# EasyEDA Pro project ProPrj_农装B类小车V2_2025-10-25.epro, board PCB4
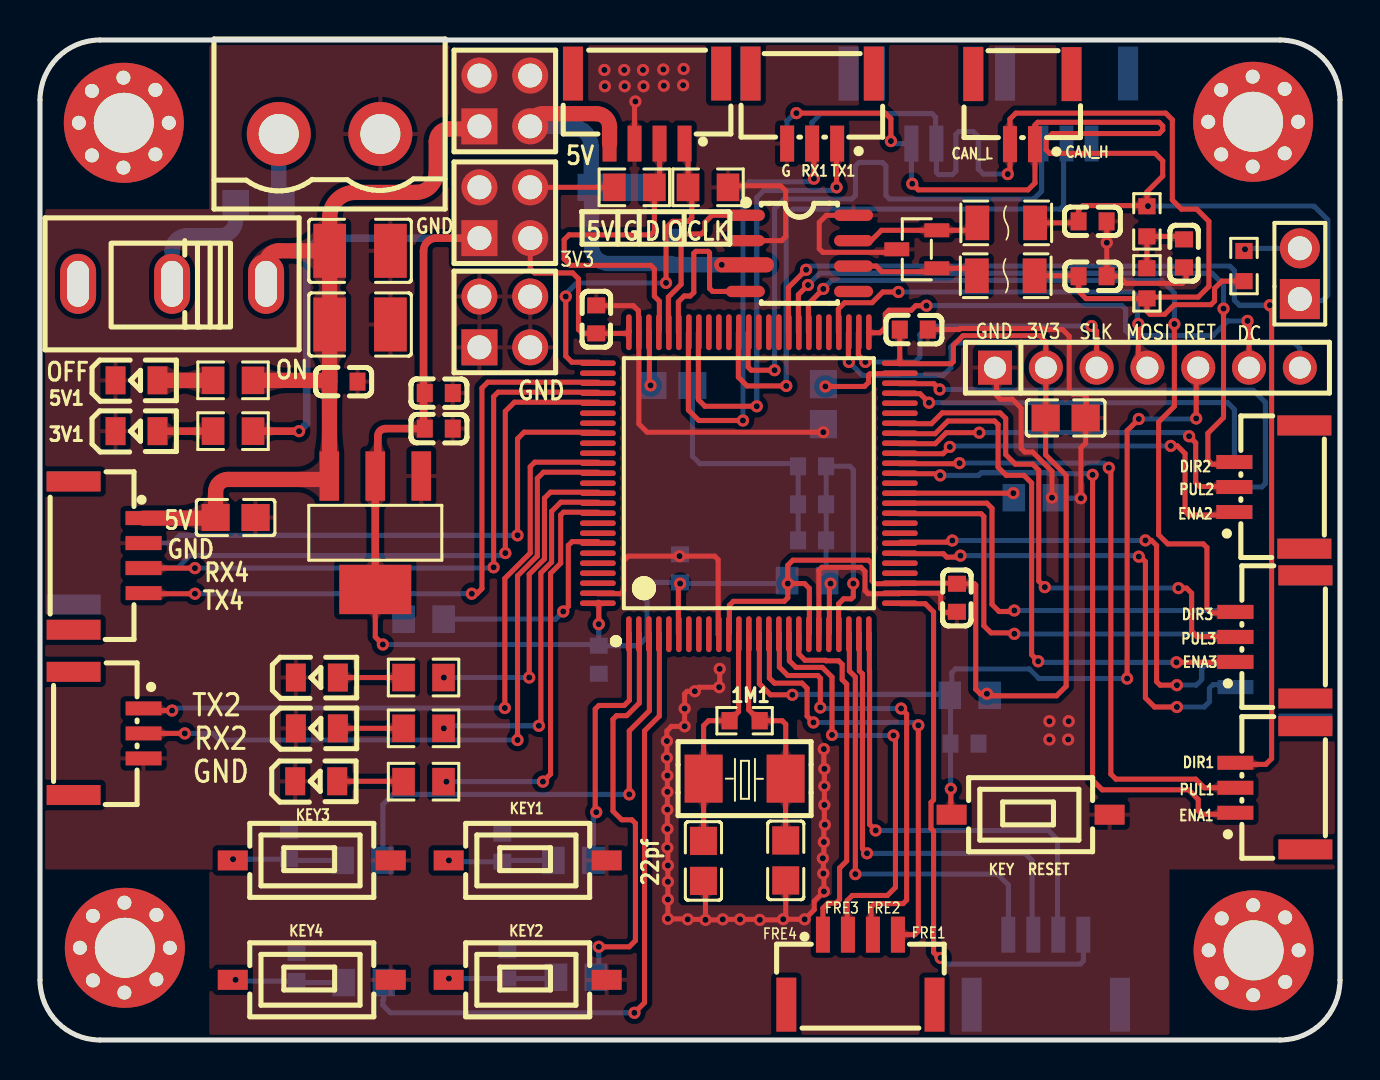
[diagram p0: board, top side]
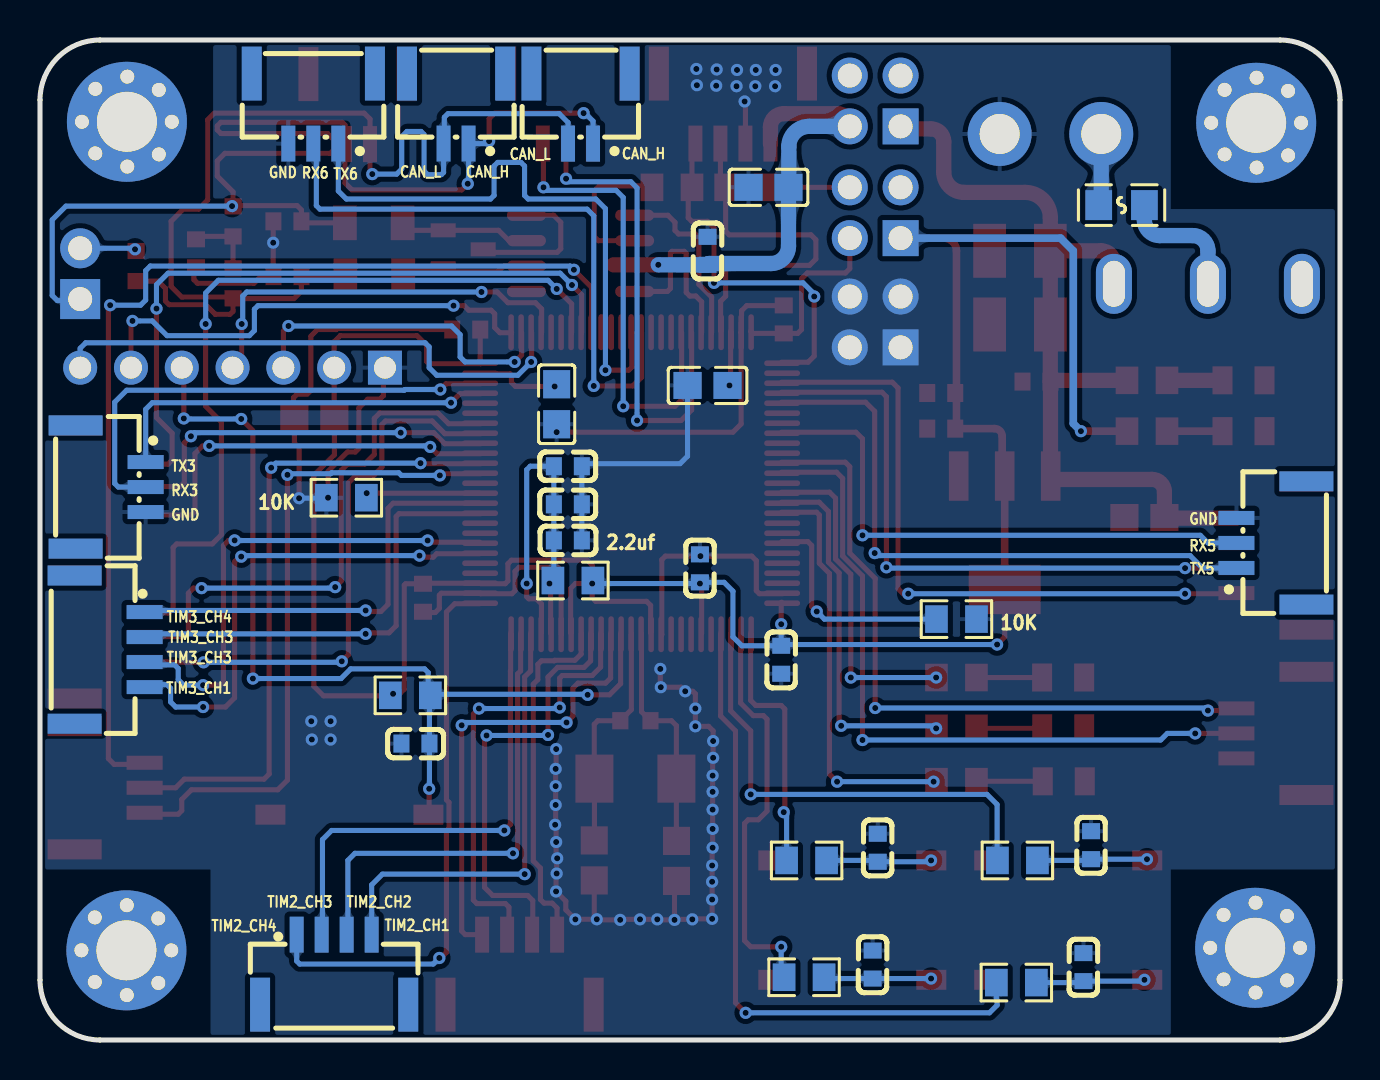
[diagram p1: board, bottom side, seen from below]

Outline 65 x 50 mm; copper layers: Top Layer, Bottom Layer. Coordinates in mm from the lower left corner of the outline.
Outline path: 0,47 0,3 arc(0.88,0.88) 3,0 62,0 arc(64.12,0.88) 65,3 65,47 arc(64.12,49.12) 62,50 3,50 arc(0.88,49.12) 0,47
Stack: Top Layer 0.035mm / Dielectric1 1.51mm FR4 er 4.5 / Bottom Layer 0.035mm

## Design rules (mm)
net OSC_OUT: DP2
net OSC_IN: DP2
net CAN1_L: DP5
net CAN1_H: DP5
net SWDIO: DP1
net SWCLK: DP1
net USART6_TX: DP6
net USART6_RX: DP6
net $1N9680: DP4
net $1N9681: DP4
net CAN1_RX: DP3
net CAN1_TX: DP3
template: JLCPCB Capability(Two Layers Board)
spacing copperThickness1oz (default): track to track 0.102, other pairs 0.152 to 0.3
spacing copperThickness2oz: track to track 0.203, other pairs 0.152 to 0.3
track width copperThickness1oz (default): min 0.127, default 0.254, max 2.54
track width copperThickness2oz: min 0.203, default 0.254, max 2.54
differential pair differentialPair (default): width min 0.127, default 0.254, max 2.54; gap min 0.152, default 0.152
via viaSize (default): diameter min 0.5, default 0.61, max 10; hole min 0.3, default 0.305, max 6.3

## Placement (name value [footprint] x y rotation side)
1M1  SCR0603J1K  [R0603]  35.23 15.96 0 top
2.2uf  100nF  [C0603]  38.61 24.98 0 bottom
3V1  NCD0805R1  [LED0805-R-RD]  4.83 30.44 0 top
5V1  NCD0805R1  [LED0805-R-RD]  4.83 32.98 0 top
10K  -  [R0805]  19.18 21.04 180 bottom
10K#2  -  [R0805]  49.68 27.11 0 bottom
C1  104  [C0603]  23.11 9.61 90 bottom
C1_22pf1  22pf  [C0805]  37.29 8.98 90 top
C2_22pf1  100nF  [C0805]  33.17 8.95 90 top
C5  104  [C0603]  45.85 22.11 90 top
C6  104  [C0603]  43.69 35.52 180 top
C7  104  [C0603]  32 23.58 270 bottom
C8  104  [C0603]  27.94 19.01 90 bottom
C9  104  [C0603]  27.81 36.03 270 top
C10  106  [C0603]  19.94 32.35 180 top
C22  104  [C0603]  31.62 39.46 90 bottom
C25  104  [C0805]  51.28 31.1 180 top
C26  22p  [C0603]  52.63 38.19 180 top
C27  22p  [C0603]  57.2 39.33 270 top
C34_106  106  [C0603]  38.61 26.78 180 bottom
C35_104  104  [C0603]  38.61 28.69 180 bottom
C39  104  [C0603]  46.23 14.82 0 bottom
C40  104  [C0805]  28.57 42.63 0 bottom
C43  104  [C0805]  9.78 26.12 180 top
C44  2.2uf  [C0805]  39.17 31.79 270 bottom
C45  2.2uf  [C0805]  31.62 32.73 0 bottom
C52  104  [C0603]  15.18 32.92 180 top
C53  104  [C0603]  19.94 30.57 180 top
C54  100uF  [C1210]  16 39.46 0 top
C55  100uF  [C1210]  16 35.78 0 top
C56  104  [C0603]  23.37 3.77 90 bottom
C57  104  [C0603]  12.45 9.74 90 bottom
C58  104  [C0603]  12.83 3.65 90 bottom
C64  22p  [C0603]  52.63 40.93 0 top
CN24  DB2EVC-5.08-2P-GN  [CONN-TH_2P-P5.08_DB2EVC-5.08-2P]  14.48 45.3 180 top
CN32  GH125-S04DCA-00  [CONN-SMD_4P-P1.27_GH125-S04DCA-00]  30.35 46.57 180 top
CN46  GH125-S04DCA-00  [CONN-SMD_4P-P1.27_GH125-S04DCA-00]  3.43 24.22 270 top
CN47  GH125-S04DCA-00  [CONN-SMD_4P-P1.27_GH125-S04DCA-00]  50.29 3.52 180 bottom
CN48  GH125-S04DCA-00  [CONN-SMD_4P-P1.27_GH125-S04DCA-00]  61.52 19.52 270 bottom
CN49  GH125-S04DCA-00  [CONN-SMD_4P-P1.27_GH125-S04DCA-00]  41.02 3.52 0 top
D1  NUP2105LT1G-TP  [SOT-23-3_L2.9-W1.3-P1.90-LS2.4-BR]  43.84 39.54 0 top
F1  BSMD0805-100-6V  [F0805]  10.92 41.75 0 bottom
F3  nSMD020-30V  [F1206]  48.29 38.21 0 top
F4  nSMD020-30V  [F1206]  48.31 40.86 0 top
H25  PZ254V-11-07P  [HDR-TH_7P-P2.54-V-M]  55.37 33.62 0 top
H26  A2541WV-2x2P  [HDR-TH_4P-P2.54-V-R2-C2-S2.54_A2541WV-2X2P]  23.24 35.9 0 top
H27  A2541WV-2x2P  [HDR-TH_4P-P2.54-V-R2-C2-S2.54_A2541WV-2X2P]  23.24 46.95 0 top
H28  A2541WV-2x2P  [HDR-TH_4P-P2.54-V-R2-C2-S2.54_A2541WV-2X2P]  23.24 41.36 0 top
H29  PZ254V-11-02P  [HDR-TH_2P-P2.54-V-M]  62.99 38.32 90 top
key1  TS-1092S-B3D2-G  [SW-SMD_L6.1-W3.6-LS7.9]  24.38 8.98 0 top
key2  TS-1092S-B3D2-G  [SW-SMD_L6.1-W3.6-LS7.9]  24.38 3.01 0 top
key3  TS-1092S-B3D2-G  [SW-SMD_L6.1-W3.6-LS7.9]  13.59 8.98 0 top
key4  TS-1092S-B3D2-G  [SW-SMD_L6.1-W3.6-LS7.9]  13.59 3.01 0 top
LED1  NCD0805R1  [LED0805-R-RD]  13.84 18.12 0 top
LED2  NCD0805R1  [LED0805-R-RD]  13.84 15.58 0 top
LED3  NCD0805R1  [LED0805-R-RD]  13.81 12.94 0 top
NOREF  -  [Pad_e1881]  6.44 45.86 270 top
NOREF#2  -  [Pad_e1906]  62.26 6.13 0 top
NOREF#3  -  [Pad_e1933]  2.65 2.98 0 top
NOREF#4  -  [Pad_e1896]  62.91 45.91 270 top
NOREF#5  -  [Pad_e1932]  2 4.61 270 top
NOREF#6  -  [Pad_e1884]  2.59 47.46 0 top
NOREF#7  -  [Pad_e1885]  1.95 45.86 270 top
NOREF#8  -  [Pad_e1922]  60.68 4.48 180 top
NOREF#9  -  [Pad_e1923]  6.49 4.61 270 top
NOREF#10  -  [Pad_e1925]  4.22 6.87 180 top
NOREF#11  -  [Pad_e1916]  60.66 2.24 180 top
NOREF#12  -  [Pad_e1927]  2.65 6.21 0 top
NOREF#13  -  [Pad_e1913]  59.08 6.08 0 top
NOREF#14  -  [Pad_e1905]  62.93 4.48 270 top
NOREF#15  -  [Pad_e1902]  60.63 43.67 180 top
NOREF#16  -  [Pad_e1901]  59.06 44.28 0 top
NOREF#17  -  [Pad_e1900]  58.41 45.91 270 top
NOREF#18  -  [Pad_e1886]  2.59 44.23 0 top
NOREF#19  -  [Pad_e1899]  59.06 47.51 0 top
NOREF#20  -  [Pad_e1904]  60.66 45.91 180 top
NOREF#21  -  [Pad_e1924]  5.82 6.26 0 top
NOREF#22  -  [Pad_e1903]  62.23 44.33 0 top
NOREF#23  -  [Pad_e1940]  4.24 4.61 180 top
NOREF#24  -  [Pad_e1914]  58.44 4.48 270 top
NOREF#25  -  [Pad_e1907]  60.66 6.74 180 top
NOREF#26  -  [Pad_e1897]  62.23 47.56 0 top
NOREF#27  -  [Pad_e1935]  5.82 3.03 0 top
NOREF#28  -  [Pad_e1890]  4.19 45.86 180 top
NOREF#29  -  [Pad_e1934]  4.22 2.37 180 top
NOREF#30  -  [Pad_e1898]  60.63 48.17 180 top
NOREF#31  -  [Pad_e1915]  59.08 2.85 0 top
NOREF#32  -  [Pad_e1889]  5.77 44.28 0 top
NOREF#33  -  [Pad_e1883]  4.17 48.12 180 top
NOREF#34  -  [Pad_e1917]  62.26 2.9 0 top
NOREF#35  -  [Pad_e1882]  5.77 47.51 0 top
NOREF#36  -  [Pad_e1887]  4.17 43.62 180 top
R6_1k1  1K  [R0805]  26.67 8.98 180 bottom
R7_1K1  1K  [R0805]  26.8 3.14 180 bottom
R8_1K1  1K  [R0805]  16.13 8.98 180 bottom
R10_2K1  2K  [R0805]  19.18 15.58 180 top
R10_2K2  2K  [R0805]  19.18 12.92 180 top
R10_10K1  10K  [R0805]  9.65 30.44 180 top
R10_10K2  10K  [R0805]  29.72 42.63 0 top
R10_10K3  10K  [R0805]  33.4 42.63 180 top
R13_2K1  2K  [R0805]  19.18 18.12 180 top
R13_10K1  10K  [R0805]  9.65 32.98 180 top
R19  60R  [R0603]  55.35 40.93 90 top
R20  60R4  [R0603]  55.35 37.83 90 top
R27_0Ω1  0K  [R0805]  38.35 22.97 0 bottom
R30  10K  [R0805]  46.48 17.23 180 bottom
R31  120R  [R0603]  60.2 38.7 270 top
R31_1K1  1K  [R0805]  16.18 2.87 180 bottom
RESET1  TS-1092S-B3D2-G  [SW-SMD_L6.1-W3.6-LS7.9]  49.53 11.27 0 top
U3  单刀双掷  [SW-TH_SS-12D10-G050]  6.6 37.81 180 top
U4  -  [407vgt6]  37.06 29.38 45 top
U10  SK12D07VG3  [SOT-223-4_L6.5-W3.5-P2.30-LS7.0-BR]  16.76 25.36 90 top
U13  TJA1050T/CM,118  [SOIC-8_L5.0-W4.0-P1.27-LS6.0-BL]  37.97 39.33 270 top
X1  8MHz  [CRYSTAL-SMD_L5.0-W3.2]  35.23 13.07 0 top
X2  GH125-S02DCA-00  [CONN-SMD_2P-P1.25_JUSHUO_GH125-S02DCA-00]  44.2 46.57 0 bottom
X3  GH125-S02DCA-00  [CONN-SMD_2P-P1.25_JUSHUO_GH125-S02DCA-00]  49.12 46.55 180 top
X4  GH125-S02DCA-00  [CONN-SMD_2P-P1.25_JUSHUO_GH125-S02DCA-00]  37.97 46.57 0 bottom
X5  GH125-S03DCA-00  [CONN-SMD_3P-P1.25_JUSHUO_GH125-S03DCA-00]  3.43 15.33 270 top
X6  GH125-S03DCA-00  [CONN-SMD_3P-P1.25_JUSHUO_GH125-S03DCA-00]  38.61 46.57 180 top
X7  GH125-S03DCA-00  [CONN-SMD_3P-P1.25_JUSHUO_GH125-S03DCA-00]  61.47 27.65 270 bottom
X8  GH125-S03DCA-00  [CONN-SMD_3P-P1.25_JUSHUO_GH125-S03DCA-00]  3.43 24.85 90 bottom
X9  GH125-S03DCA-00  [CONN-SMD_3P-P1.25_JUSHUO_GH125-S03DCA-00]  61.52 12.61 90 top
X11  GH125-S03DCA-00  [CONN-SMD_3P-P1.25_JUSHUO_GH125-S03DCA-00]  61.52 20.16 90 top
X12  GH125-S03DCA-00  [CONN-SMD_3P-P1.25_JUSHUO_GH125-S03DCA-00]  61.47 27.65 90 top
X13  GH125-S03DCA-00  [CONN-SMD_3P-P1.25_JUSHUO_GH125-S03DCA-00]  51.33 46.57 0 bottom

## Footprints (pads in the part's own frame, mm; a bottom-side part is the same pattern mirrored in y, then rotated)
407vgt6
  oval 0.28x1.796 smd rot 135: 1(-11.809,-1.04) 2(-11.456,-1.393) 3(-11.101,-1.747) 4(-10.748,-2.1) 5(-10.394,-2.454) 6(-10.041,-2.808) 7(-9.687,-3.161) 8(-9.334,-3.514) 9(-8.98,-3.868) 10(-8.627,-4.221) 11(-8.273,-4.575) 12(-7.92,-4.929) 13(-7.566,-5.282) 14(-7.213,-5.636) 15(-6.859,-5.989) 16(-6.505,-6.343) 17(-6.152,-6.697) 18(-5.798,-7.05) 19(-5.445,-7.404) 20(-5.091,-7.757) 21(-4.737,-8.111) 22(-4.384,-8.464) 23(-4.03,-8.818) 24(-3.677,-9.171) 25(-3.323,-9.525) 51(7.354,1.152) 52(7,1.506) 53(6.646,1.859) 54(6.293,2.213) 55(5.939,2.567) 56(5.586,2.92) 57(5.232,3.273) 58(4.879,3.627) 59(4.525,3.981) 60(4.172,4.334) 61(3.818,4.688) 62(3.465,5.041) 63(3.111,5.395) 64(2.757,5.748) 65(2.404,6.102) 66(2.05,6.455) 67(1.697,6.809) 68(1.343,7.162) 69(0.99,7.516) 70(0.636,7.87) 71(0.282,8.223) 72(-0.071,8.577) 73(-0.424,8.931) 74(-0.778,9.284) 75(-1.131,9.637)
  oval 1.796x0.28 smd rot 135: 26(-1.131,-9.525) 27(-0.778,-9.171) 28(-0.424,-8.818) 29(-0.071,-8.464) 30(0.282,-8.111) 31(0.636,-7.758) 32(0.99,-7.404) 33(1.343,-7.05) 34(1.697,-6.697) 35(2.05,-6.343) 36(2.404,-5.989) 37(2.757,-5.636) 38(3.111,-5.282) 39(3.465,-4.928) 40(3.818,-4.575) 41(4.172,-4.221) 42(4.525,-3.868) 43(4.879,-3.514) 44(5.232,-3.161) 45(5.586,-2.808) 46(5.939,-2.454) 47(6.293,-2.1) 48(6.646,-1.747) 49(7,-1.393) 50(7.354,-1.04) 76(-3.324,9.637) 77(-3.677,9.284) 78(-4.03,8.931) 79(-4.384,8.577) 80(-4.737,8.223) 81(-5.091,7.87) 82(-5.445,7.516) 83(-5.798,7.162) 84(-6.152,6.809) 85(-6.505,6.455) 86(-6.859,6.102) 87(-7.213,5.748) 88(-7.566,5.395) 89(-7.92,5.042) 90(-8.273,4.688) 91(-8.627,4.334) 92(-8.98,3.981) 93(-9.334,3.627) 94(-9.688,3.273) 95(-10.041,2.92) 96(-10.395,2.567) 97(-10.748,2.213) 98(-11.101,1.859) 99(-11.456,1.506) 100(-11.809,1.152)
C0603
  rect 0.8x0.9 smd: 1(-0.7,0) 2(0.7,0)
C0805
  rect 1.41x1.35 smd: 1(-1,0) 2(1,0)
C1210
  rect 1.635x2.7 smd: 1(-1.518,0) 2(1.518,0)
CONN-SMD_2P-P1.25_JUSHUO_GH125-S02DCA-00
  rect 0.7x1.8 smd: 1(-0.625,1.75) 2(0.625,1.75)
  rect 1x2.7 smd: 3(2.455,-1.75) 4(-2.455,-1.75)
CONN-SMD_3P-P1.25_JUSHUO_GH125-S03DCA-00
  rect 0.7x1.8 smd: 1(-1.25,1.75) 2(0,1.75) 3(1.25,1.75)
  rect 1x2.7 smd: 4(3.08,-1.75) 5(-3.08,-1.75)
CONN-SMD_4P-P1.27_GH125-S04DCA-00
  rect 0.7x1.8 smd: 1(-1.875,1.75) 2(-0.625,1.75) 3(0.625,1.75) 4(1.875,1.75)
  rect 1x2.7 smd: 5(3.705,-1.75) 6(-3.705,-1.75)
CONN-TH_2P-P5.08_DB2EVC-5.08-2P
  round 3.2 hole 2: 1(-2.54,0) 2(2.54,0)
CRYSTAL-SMD_L5.0-W3.2
  rect 1.9x2.401 smd: 1(-2.05,0) 2(2.05,0)
F0805
  rect 1.335x1.5 smd: 1(-1.143,0) 2(1.143,0)
F1206
  rect 1.19x1.728 smd: 1(-1.445,0) 2(1.445,0)
HDR-TH_2P-P2.54-V-M
  rect 2x2 hole 1.2: 1(-1.27,0)
  round 2 hole 1.2: 2(1.27,0)
HDR-TH_4P-P2.54-V-R2-C2-S2.54_A2541WV-2X2P
  rect 1.8x1.8 hole 1.2: 1(-1.27,-1.27)
  round 1.8 hole 1.2: 2(-1.27,1.27) 3(1.27,-1.27) 4(1.27,1.27)
HDR-TH_7P-P2.54-V-M
  rect 1.7x1.7 hole 1.1: 1(-7.62,0)
  round 1.7 hole 1.1: 2(-5.08,0) 3(-2.54,0) 4(0,0) 5(2.54,0) 6(5.08,0) 7(7.62,0)
LED0805-R-RD
  rect 1x1.399 smd: 1(1.05,0) 2(-1.05,0)
Pad_e1881
  round 1.2 hole 0.7: 1(0,0)
Pad_e1882
  round 1.2 hole 0.7: 1(0,0)
Pad_e1883
  round 1.2 hole 0.7: 1(0,0)
Pad_e1884
  round 1.2 hole 0.7: 1(0,0)
Pad_e1885
  round 1.2 hole 0.7: 1(0,0)
Pad_e1886
  round 1.2 hole 0.7: 1(0,0)
Pad_e1887
  round 1.2 hole 0.7: 1(0,0)
Pad_e1889
  round 1.2 hole 0.7: 1(0,0)
Pad_e1890
  round 6 hole 3: 1(0,0)
Pad_e1896
  round 1.2 hole 0.7: 1(0,0)
Pad_e1897
  round 1.2 hole 0.7: 1(0,0)
Pad_e1898
  round 1.2 hole 0.7: 1(0,0)
Pad_e1899
  round 1.2 hole 0.7: 1(0,0)
Pad_e1900
  round 1.2 hole 0.7: 1(0,0)
Pad_e1901
  round 1.2 hole 0.7: 1(0,0)
Pad_e1902
  round 1.2 hole 0.7: 1(0,0)
Pad_e1903
  round 1.2 hole 0.7: 1(0,0)
Pad_e1904
  round 6 hole 3: 1(0,0)
Pad_e1905
  round 1.2 hole 0.7: 1(0,0)
Pad_e1906
  round 1.2 hole 0.7: 1(0,0)
Pad_e1907
  round 1.2 hole 0.7: 1(0,0)
Pad_e1913
  round 1.2 hole 0.7: 1(0,0)
Pad_e1914
  round 1.2 hole 0.7: 1(0,0)
Pad_e1915
  round 1.2 hole 0.7: 1(0,0)
Pad_e1916
  round 1.2 hole 0.7: 1(0,0)
Pad_e1917
  round 1.2 hole 0.7: 1(0,0)
Pad_e1922
  round 6 hole 3: 1(0,0)
Pad_e1923
  round 1.2 hole 0.7: 1(0,0)
Pad_e1924
  round 1.2 hole 0.7: 1(0,0)
Pad_e1925
  round 1.2 hole 0.7: 1(0,0)
Pad_e1927
  round 1.2 hole 0.7: 1(0,0)
Pad_e1932
  round 1.2 hole 0.7: 1(0,0)
Pad_e1933
  round 1.2 hole 0.7: 1(0,0)
Pad_e1934
  round 1.2 hole 0.7: 1(0,0)
Pad_e1935
  round 1.2 hole 0.7: 1(0,0)
Pad_e1940
  round 6 hole 3: 1(0,0)
R0603
  rect 0.806x0.864 smd: 1(-0.753,0) 2(0.753,0)
R0805
  rect 1.133x1.377 smd: 1(-1,0) 2(1,0)
SOIC-8_L5.0-W4.0-P1.27-LS6.0-BL
  oval 0.569x1.95 smd: 1(-1.905,-2.705) 2(-0.635,-2.705) 3(0.635,-2.705) 4(1.905,-2.705) 5(1.905,2.705) 6(0.635,2.705) 7(-0.635,2.705) 8(-1.905,2.705)
SOT-23-3_L2.9-W1.3-P1.90-LS2.4-BR
  rect 1.25x0.7 smd: 1(1,-0.95) 2(1,0.95) 3(-1,0)
SOT-223-4_L6.5-W3.5-P2.30-LS7.0-BR
  rect 2.47x0.98 smd: 1(2.835,-2.3) 2(2.835,0) 3(2.835,2.3)
  rect 2.47x3.6 smd: 4(-2.835,0)
SW-SMD_L6.1-W3.6-LS7.9
  rect 1.5x1 smd: 1(-3.95,0) 2(3.95,0)
SW-TH_SS-12D10-G050
  oval 1.8x3 hole 1.1x2.3: 1(-4.7,0) 2(0,0) 3(4.7,0)

## Nets
GND: 2.2uf.1 3V1.2 5V1.2 10K.2 10K#2.2 C1.2 C1_22pf1.1 C2_22pf1.1 C5.1 C6.1 C7.1 C8.1 C9.1 C10.1 C22.2 C25.1 C26.1 C27.2 C34_106.2 C35_104.2 C39.2 C40.2 C43.1 C44.2 C45.2 C52.1 C53.1 C54.2 C55.2 C56.2 C57.2 C58.2 C64.2 CN24.1 CN32.3 CN46.2 D1.3 H25.1 H26.1 H26.2 H26.3 H26.4 key1.2 key2.2 key3.2 key4.2 LED1.2 LED2.2 LED3.2 R10_10K3.1 RESET1.2 U4.10 U4.20 U4.27 U4.74 U4.99 U10.1 U13.2 U13.8 X5.3 X6.3 X7.3 X8.3 X13.3
VCC3V3: C5.2 C6.2 C7.2 C8.2 C9.2 C10.2 C25.2 C53.2 H25.2 H28.1 H28.2 H28.3 H28.4 R10_10K1.1 R10_10K2.1 R27_0Ω1.1 R30.1 U4.6 U4.11 U4.19 U4.28 U4.50 U4.75 U4.100 U10.2 U10.4
VCC5V: C22.1 C40.1 C43.2 C52.2 C54.1 C55.1 CN32.4 CN46.1 H27.1 H27.2 H27.3 H27.4 R13_10K1.1 U3.1 U10.3 U13.3
BOOT0: 10K.1 U4.94
BOOT1: 10K#2.1 U4.37
CAN1_H: C64.1 F4.2 H29.1 R19.2 X2.1 X3.1 X4.1
CAN1_L: C26.2 F3.2 R20.1 R31.2 X2.2 X3.2 X4.2
CAN1_RX: U4.70 U13.4
CAN1_TX: U4.71 U13.1
FREE_IO1: CN49.4 U4.15
FREE_IO2: CN49.3 U4.16
FREE_IO3: CN49.2 U4.17
FREE_IO4: CN49.1 U4.18
KEY1: R6_1k1.1 U4.1
KEY2: R7_1K1.1 U4.2
KEY3: R8_1K1.1 U4.3
KEY4: R31_1K1.1 U4.4
LED1: R13_2K1.1 U4.89
LED2: R10_2K1.1 U4.90
LED3: R10_2K2.1 U4.91
M1_DIR: U4.59 X9.3
M1_ENA: U4.39 X9.1
M1_PUL: U4.40 X9.2
M2_DIR: U4.58 X12.3
M2_ENA: U4.41 X12.1
M2_PUL: U4.42 X12.2
M3_DIR: U4.57 X11.3
M3_ENA: U4.43 X11.1
M3_PUL: U4.44 X11.2
OLED_CS: H25.7 U4.53
OLED_DC: H25.6 U4.51
OLED_MOSI: H25.4 U4.54
OLED_SCK: H25.3 U4.52
OSC_IN: 1M1.1 C2_22pf1.2 U4.12 X1.1
OSC_OUT: 1M1.2 C1_22pf1.2 U4.13 X1.2
POWER5V: F1.1 U3.2
RESET: C39.1 H25.5 R30.2 RESET1.1 U4.14
SWCLK: CN32.1 R10_10K3.2 U4.76
SWDIO: CN32.2 R10_10K2.2 U4.72
TIM2_CH1: CN47.4 U4.23
TIM2_CH2: CN47.3 U4.24
TIM2_CH3: CN47.2 U4.25
TIM2_CH4: CN47.1 U4.26
TIM3_CH1: CN48.4 U4.31
TIM3_CH2: CN48.3 U4.32
TIM3_CH3: CN48.2 U4.35
TIM3_CH4: CN48.1 U4.36
USART1_RX: U4.69 X6.2
USART1_TX: U4.68 X6.1
USART2_RX: U4.87 X5.2
USART2_TX: U4.86 X5.1
USART3_RX: U4.48 X7.2
USART3_TX: U4.47 X7.1
USART4_RX: CN46.3 U4.79
USART4_TX: CN46.4 U4.78
USART5_RX: U4.83 X8.2
USART5_TX: U4.80 X8.1
USART6_RX: U4.64 X13.2
USART6_TX: U4.63 X13.1
$1N9341: U4.92
$1N9342: U4.93
$1N9363: C44.1 U4.49
$1N9364: C45.1 U4.73
$1N9368: 2.2uf.2 C34_106.1 C35_104.1 R27_0Ω1.2 U4.21 U4.22
$1N9402: C1.1 key1.1 R6_1k1.2
$1N9403: C56.1 key2.1 R7_1K1.2
$1N9404: C57.1 key3.1 R8_1K1.2
$1N9411: C58.1 key4.1 R31_1K1.2
$1N9414: 3V1.1 R10_10K1.2
$1N9417: 5V1.1 R13_10K1.2
$1N9419: LED2.1 R10_2K1.2
$1N9423: LED1.1 R13_2K1.2
$1N9463: CN24.2 F1.2
$1N9521: U4.77
$1N9522: U4.30
$1N9524: U4.29
$1N9534: LED3.1 R10_2K2.2
$1N9548: U4.96
$1N9550: U4.95
$1N9554: U4.67
$1N9559: U4.61
$1N9561: U4.62
$1N9565: U4.60
$1N9571: U4.66
$1N9572: U4.65
$1N9579: U4.7
$1N9597: U4.45
$1N9599: U4.46
$1N9609: U4.55
$1N9611: U4.56
$1N9617: U4.33
$1N9619: U4.34
$1N9629: U4.98
$1N9631: U4.97
$1N9680: D1.1 F3.1 U13.6
$1N9681: D1.2 F4.1 U13.7
$1N9688: C27.1 R19.1 R20.2
$1N17080: H29.2 R31.1
$1N17120: U4.5
$1N17124: U4.38
$1N17129: U4.81
$1N17133: U4.82
$1N17138: U4.84
$1N17143: U4.85
$1N17148: U4.88

Pads without a net: CN32 5 6; CN46 5 6; CN47 5 6; CN48 5 6; CN49 5 6; NOREF 1; NOREF#2 1; NOREF#3 1; NOREF#4 1; NOREF#5 1; NOREF#6 1; NOREF#7 1; NOREF#8 1; NOREF#9 1; NOREF#10 1; NOREF#11 1; NOREF#12 1; NOREF#13 1; NOREF#14 1; NOREF#15 1; NOREF#16 1; NOREF#17 1; NOREF#18 1; NOREF#19 1; NOREF#20 1; NOREF#21 1; NOREF#22 1; NOREF#23 1; NOREF#24 1; NOREF#25 1; NOREF#26 1; NOREF#27 1; NOREF#28 1; NOREF#29 1; NOREF#30 1; NOREF#31 1; NOREF#32 1; NOREF#33 1; NOREF#34 1; NOREF#35 1; NOREF#36 1; U3 3; U4 8 9; U13 5; X2 3 4; X3 3 4; X4 3 4; X5 4 5; X6 4 5; X7 4 5; X8 4 5; X9 4 5; X11 4 5; X12 4 5; X13 4 5

## Via types
v1: diameter 0.61, hole 0.305, Top Layer to Bottom Layer, 153 vias

## Routing (per net, layer and track width the routed paths; a pad name or vN(x,y) marks a point on that pad's centre or on a via; arc(x,y) is an arc through that point)
GND: length 138.4
  Top Layer w0.254: 33.92,20.26 33.91,20.27 33.91,24.02 33.73,24.19 v1(31.98,24.19) 29.41,24.19 29.18,23.97 29.18,22.47 29.03,22.31 27.87,22.31 ; v1(37.16,6.04) 37.29,6.16 C1_22pf1.1 ; v1(37.16,6.04) 37.13,6.01 v1(35.99,6.01) 35.97,6.03 v1(35,6.03) v1(34.14,6.03) 34.11,6.01 v1(33.27,6.01) ; v1(37.16,6.04) 38.23,6.04 v1(38.23,6.03) 38.71,6.51 38.71,6.94 v1(39.2,7.43) 39.2,8.29 v1(39.17,8.32) 39.17,9.06 v1(39.14,9.09) 39.19,9.14 v1(39.19,9.9) 39.19,10.71 v1(39.24,10.76) 39.22,10.79 v1(39.22,11.75) v1(39.22,12.69) v1(39.22,13.56) 39.19,13.58 v1(39.19,14.55) ; v1(33.27,6.01) 33.25,6.03 v1(32.38,6.03) 32.36,6.06 v1(31.39,6.06) v1(31.39,7.02) v1(31.39,7.91) v1(31.39,8.73) 31.39,9.59 v1(31.37,9.61) v1(31.37,10.55) v1(31.37,11.52) v1(31.37,12.41) v1(31.37,13.22) 31.37,14.08 v1(31.34,14.11) v1(31.34,14.95) 31.34,15.46 31.57,15.68 v1(32.23,15.68) v1(32.23,16.57) 32.23,17.31 32.36,17.44 v1(32.74,17.44) 32.94,17.64 v1(33.96,17.64) 33.99,17.67 v1(33.99,18.56) ; v1(33.27,6.01) 33.27,7.85 C2_22pf1.1 ; U13.8 39.32,41.24 38.96,40.88 38.96,39.56 39.14,39.38 42.69,39.38 D1.3 ; U4.74 29.94,35.36 ; U4.74 29.92,36.47 29.67,36.72 27.83,36.72 C9.1 ; U4.74 29.94,35.36 ; 29.94,35.36 29.94,30.8 30.35,30.39 v1(39.17,30.39) ; C27.2 57.3,38.53 57.3,38.01 57.12,37.83 54.31,37.83 53.95,38.19 C26.1 53.34,38.2 v1(53.34,39.87) 53.34,40.92 C64.2 ; U4.20 38.94,23.48 39.09,23.63 41.05,23.63 41.25,23.43 41.25,22.47 41.4,22.31 42.97,22.31 U4.27 44.93,22.34 45.03,22.24 45.03,21.58 45.24,21.37 45.81,21.37 C5.1 ; v1(29.77,46.93) 29.73,46.89 CN32.3 ; 35.27,39.97 37.08,39.97 37.29,40.17 37.29,42.46 37.03,42.71 34.48,42.71 R10_10K3.1 ; C6.1 45.95,35.52 46,35.57 50.13,35.57 50.19,35.52 51.13,35.52 51.46,35.19 51.46,32.47 51.64,32.29 52.15,32.29 52.33,32.12 52.33,31.86 52.28,31.82 C25.1 52.28,29.84 52.04,29.6 v1(52.04,27.09) ; v1(50.6,27.11) 50.6,28.43 49.63,29.4 49.24,29.4 49.06,29.58 49.06,31.6 48.62,32.04 48.01,32.04 47.83,32.22 47.83,33.54 H25.1
  Bottom Layer w0.254: C45.2 32.62,29.19 32.99,28.82 37.78,28.82 37.91,28.69 37.91,24.98 ; v1(52.04,27.09) 50.71,27.09 10K#2.2
  vias: v1(28.22,48.5) v1(28.25,47.69) v1(29.21,48.5) v1(29.24,47.69) v1(30.15,48.5) v1(30.18,47.69) v1(31.17,48.53) v1(31.19,47.71) v1(32.18,48.55) v1(32.16,47.74) v1(50.47,15.94) v1(50.47,15.02) v1(51.44,15.94) v1(51.41,15.02)
VCC3V3: length 144.6
  Top Layer w0.254: 31.95,22.82 31.92,22.79 31.92,20.34 ; H28.3 24.51,38.57 24.73,38.35 26.63,38.35 26.92,38.06 26.92,35.52 27.12,35.33 C9.2 29.36,35.33 29.47,35.44 ; C6.2 42.99,33.83 42.97,33.81 45.56,33.81 45.67,33.92 45.67,34.73 46.15,35.22 49.99,35.22 50.29,34.91 H25.2 50.29,31.11 C25.2 50.28,29.26 51.31,28.23 51.31,17.69 50.83,17.21 47.45,17.21 v1(47.35,17.31) 47.02,17.31 46.79,17.54 46.79,22.75 46.72,22.81 C5.2 ; 42.97,22.81 41.74,22.81 41.6,22.95 41.6,23.81 41.43,23.99 37.64,23.99 37.39,23.74 v1(37.39,22.82) ; 38.47,20.34 38.47,22.58 38.23,22.82 v1(37.39,22.82) ; 27.92,21.89 27.94,21.87 v1(27.94,20.79) ; v1(37.39,22.82) 37.39,22.11 37.21,21.93 34.67,21.93 34.47,21.73 34.47,20.34 ; 45.85,22.76 45.82,22.79 ; 45.77,22.84 43.02,22.84 ; H28.4 R10_10K2.1 ; 16.76,22.53 16.76,20.16 v1(17.15,19.77)
  Top Layer w0.381: H28.1 19.81,40.09 arc(19.36,39.91) 19.18,39.46 19.18,30.63 arc(19.2,30.59) C53.2 17.27,30.57 arc(17,30.46) 16.89,30.19 16.89,28.32 arc(16.85,28.23) U10.2 16.76,22.53 ; v1(12.95,30.44) R10_10K1.1
  Bottom Layer w0.254: 27.81,19.71 27.75,19.77 v1(17.15,19.77) ; v1(27.94,20.79) C8.2 29.91,19.71 30.35,20.16 30.35,22.44 30.8,22.88 C7.2 ; v1(32,22.82) 37.2,22.82 R27_0Ω1.1
  Bottom Layer w0.381: H28.1 13.97,40.09 13.34,39.46 13.34,30.82 v1(12.95,30.44)
VCC5V: length 66.1
  Top Layer w0.762: C54.1 14.48,41.12 arc(14.85,42.01) 15.75,42.38 18.8,42.38 arc(19.51,42.68) 19.81,43.4 19.81,44.92 arc(20,45.37) 20.45,45.56 21.84,45.56 arc(21.93,45.59) H27.1 ; C54.1 11.94,39.46 arc(11.49,39.27) 11.3,38.83 U3.1 ; C54.1 C55.1 14.48,32.93 C52.2 14.47,28.21 U10.3 arc(14.41,28.08) 14.3,28.03 9.4,28.03 arc(8.96,27.85) 8.78,27.41 C43.2 ; CN46.1 8.35,26.09 arc(8.37,26.1) 8.38,26.12 ; v1(34.09,38.76) 36.32,38.76 ; 14.41,32.98 R13_10K1.1 ; CN32.4 28.48,45.65 arc(28.28,46.12) 27.81,46.32 25.15,46.32 arc(24.7,46.13) H27.3
  Bottom Layer w0.762: H27.3 26.54,45.68 arc(27.26,45.38) 27.56,44.67 27.56,42.65 arc(27.56,42.64) C40.1 27.57,39.7 arc(27.83,39.08) 28.45,38.82 31.56,38.82 arc(31.6,38.8) C22.1 v1(34.09,38.76)
BOOT0: length 11.1
  Top Layer w0.254: 27.92,24.89 27.89,24.92 26.61,24.92 26.42,24.73 26.42,21.68 v1(26.16,21.43)
  Bottom Layer w0.254: 10K.1 25.78,21.04 v1(26.16,21.43)
BOOT1: length 5.6
  Top Layer w0.254: 43.02,27.34 48.66,27.34 v1(48.67,27.34)
CAN1_H: length 62.9
  Top Layer w0.254: v1(42.54,44.95) 42.54,46.06 42.27,46.34 v1(37.82,46.34) ; v1(55.4,41.69) 55.35,41.69 R19.2 55.35,42.41 56.14,43.19 56.14,43.95 55.75,44.33 50.49,44.33 50.31,44.51 50.31,45.01 50.62,45.32 55.96,45.32 56.14,45.5 56.14,45.71 55.96,45.89 49.89,45.89 49.75,45.75 X3.1 49.75,42.85 49.4,42.51 43.92,42.51 v1(43.61,42.81) ; F4.2 51.85,40.86 C64.1 51.93,41.5 52.15,41.72 55.29,41.72
  Bottom Layer w0.254: H29.1 63.07,36.97 64.13,36.97 64.39,37.22 64.39,41.01 63.7,41.69 v1(55.4,41.69) ; v1(42.54,44.95) 42.67,44.82 X2.1 43.57,42.85 v1(43.61,42.81) ; v1(37.82,46.34) 37.74,46.34 37.35,45.95 X4.1
CAN1_L: length 54.9
  Top Layer w0.254: R20.1 55.34,37.07 52.3,37.07 51.93,37.44 C26.2 51.9,38.21 F3.2 ; R20.1 55.41,37.15 57.91,37.15 58.45,37.68 58.45,40.93 57.84,41.54 57.07,41.54 56.62,42 56.62,46.01 56.29,46.34 48.79,46.34 48.5,46.05 X3.2 48.5,43.41 v1(48.39,43.29) ; R20.1 55.35,36.44 55.5,36.28 56.24,36.28 56.72,36.77 58.55,36.77 58.73,36.95 58.73,37.58 59.09,37.94 R31.2
  Bottom Layer w0.254: X4.2 38.6,45.88 39.04,46.32 44.6,46.32 44.78,46.14 44.78,44.86 X2.2 44.82,43.38 44.93,43.27 45.62,43.27 45.8,43.45 45.8,45.28 45.95,45.43 46.65,45.43 46.91,45.17 46.91,43.55 47.17,43.29 v1(48.39,43.29)
CAN1_RX: length 9
  Top Layer w0.254: U13.4 33.63,37.43 33.48,37.58 33.48,38.51 33.48,39.36 33.4,39.43 32.79,39.43 32.69,39.33 32.69,37.38 32.51,37.2 32.21,37.2 31.92,36.91 31.92,35.36
CAN1_TX: length 8.9
  Top Layer w0.254: U13.1 33.6,41.24 33.25,40.88 33.25,40.48 33.07,40.3 32.23,40.3 32.06,40.12 32.06,37.78 31.42,37.15 31.42,35.36
FREE_IO1: length 22.9
  Top Layer w0.254: v1(38.67,15.88) 38.35,16.19 38.35,17.59 38.1,17.84 36.72,17.84 36.47,18.1 36.47,20.34 ; CN49.4 42.9,5.27 43.74,5.27 43.92,5.45 v1(43.92,15.74)
  Bottom Layer w0.254: v1(38.67,15.88) 43.78,15.88 v1(43.92,15.74)
FREE_IO2: length 22.5
  Top Layer w0.254: CN49.3 41.55,5.36 41.55,6.64 41.73,6.82 43.15,6.82 43.33,7 43.33,16.29 v1(43.05,16.57) ; v1(39.01,16.62) 39.01,18.1 38.89,18.22 37.39,18.22 36.97,18.64 36.97,20.34
  Bottom Layer w0.254: v1(43.05,16.57) 39.07,16.57 v1(39.01,16.62)
FREE_IO3: length 21.9
  Top Layer w0.254: v1(39.6,15.25) 39.6,18.15 39.12,18.63 37.79,18.63 37.47,18.96 37.47,20.34 ; v1(42.67,15.23) 42.77,15.13 42.77,7.63 42.37,7.23 40.61,7.23 40.36,6.97 40.36,5.3 CN49.2
  Bottom Layer w0.254: v1(42.67,15.23) 39.62,15.23 v1(39.6,15.25)
FREE_IO4: length 17.7
  Top Layer w0.254: U4.18 37.94,19.3 38.25,18.99 39.26,18.99 39.29,18.96 39.93,18.96 40.11,18.78 40.11,18.02 40.34,17.79 40.34,8.95 39.98,8.6 39.98,7.02 39.8,6.84 39.39,6.84 39.15,6.6 CN49.1
KEY1: length 12.9
  Top Layer w0.254: v1(27.81,11.39) 27.76,11.44 27.76,16.55 27.94,16.73 29.21,16.73 29.47,16.98 29.47,20.34
  Bottom Layer w0.254: R6_1k1.1 27.67,11.25 v1(27.81,11.39)
KEY2: length 20.5
  Top Layer w0.254: v1(27.94,4.66) 29.46,4.66 29.77,4.97 29.77,10.83 29.59,11.01 29.08,11.01 28.65,11.44 28.65,16.04 28.83,16.22 29.34,16.22 29.97,16.85 29.97,20.34
  Bottom Layer w0.254: R7_1K1.1 27.94,3.28 v1(27.94,4.66)
KEY3: length 23.8
  Top Layer w0.254: 30.47,20.34 30.47,16.46 29.46,15.46 v1(29.46,12.28)
  Bottom Layer w0.254: v1(29.46,12.28) 17.65,12.28 17.15,11.77 17.15,9 R8_1K1.1
KEY4: length 33.4
  Top Layer w0.254: 30.97,20.34 30.97,16.2 30.23,15.46 30.23,1.87 v1(29.72,1.36)
  Bottom Layer w0.254: v1(29.72,1.36) 17.53,1.36 17.15,1.74 17.15,1.99 17.18,2.03 R31_1K1.1
LED1: length 16.4
  Top Layer w0.254: 27.92,27.39 25.52,27.39 25.22,27.09 25.22,24.05 24.46,23.29 v1(24.46,18.12) ; v1(20.19,18.12) R13_2K1.1
  Bottom Layer w0.254: v1(24.46,18.12) v1(20.19,18.12)
LED2: length 18.3
  Top Layer w0.254: v1(24.94,15.71) 25.04,15.81 25.04,23.36 25.58,23.89 25.58,26.43 26.04,26.89 27.92,26.89
  Bottom Layer w0.254: v1(24.94,15.71) 20.32,15.71 v1(20.19,15.58)
LED3: length 20.5
  Top Layer w0.254: v1(25.15,12.92) 25.53,13.3 25.53,23.33 26.03,23.84 26.03,26.25 26.17,26.39 27.92,26.39
  Bottom Layer w0.254: v1(25.15,12.92) v1(20.32,12.92)
M1_DIR: length 53.1
  Top Layer w0.254: v1(38.31,38.51) 37.42,37.62 37.42,35.36 ; X9.3 59.85,13.78 61.29,13.78 61.58,14.07 61.58,36.65 v1(61.49,36.74)
  Bottom Layer w0.254: v1(61.49,36.74) 59.97,36.74 59.72,36.99 59.72,38.47 59.49,38.7 38.49,38.7 v1(38.31,38.51)
M1_ENA: length 33.3
  Top Layer w0.254: 42.97,28.31 44.92,28.31 v1(45.01,28.23) ; X9.1 59.7,11.29 58.09,11.29 57.91,11.47 57.91,12.03 57.43,12.51 53.11,12.51 52.63,12.99 v1(52.63,28.26)
  Bottom Layer w0.254: v1(52.63,28.26) 52.57,28.31 50.47,28.31 50.42,28.36 47.06,28.36 46.93,28.23 v1(45.01,28.23)
M1_PUL: length 32.4
  Top Layer w0.254: 42.97,28.81 45.95,28.81 v1(45.97,28.84) ; v1(53.44,28.61) 53.54,28.51 53.54,13.3 53.8,13.04 57.78,13.04 58.22,12.61 59.77,12.61
  Bottom Layer w0.254: v1(53.44,28.61) 53.21,28.84 v1(45.97,28.84)
M2_DIR: length 34.4
  Top Layer w0.254: v1(59.18,36.57) 59.18,31.12 58.39,30.34 58.39,28.99 58.6,28.79 59.61,28.79 X12.3 ; 37.92,35.36 37.92,37.27 v1(38.4,37.75)
  Bottom Layer w0.254: v1(38.4,37.75) 38.99,38.34 58.6,38.34 59.18,37.76 v1(59.18,36.57)
M2_ENA: length 20.1
  Top Layer w0.254: X12.1 59.57,26.25 57.43,26.25 57.25,26.43 57.25,29.32 56.87,29.71 v1(56.54,29.71) ; v1(45.49,29.65) 45.15,29.31 42.97,29.31
  Bottom Layer w0.254: v1(45.49,29.65) 45.54,29.71 v1(56.54,29.71)
M2_PUL: length 19.3
  Top Layer w0.254: 42.97,29.81 44.76,29.81 45.31,30.37 v1(46.96,30.37) ; v1(57.46,30.19) 57.78,29.86 57.78,27.88 57.99,27.67 59.69,27.67 X12.2
  Bottom Layer w0.254: v1(46.96,30.37) 57.28,30.37 v1(57.46,30.19)
M3_DIR: length 40.2
  Top Layer w0.254: v1(39.16,37.55) 38.42,36.81 38.42,35.36 ; X11.3 59.71,21.35 58.57,21.35 58.35,21.58 58.35,24.62 58.17,24.8 56.39,24.8 55.93,25.26 55.93,30.9 56.72,31.69 v1(56.72,35.8)
  Bottom Layer w0.254: v1(56.72,35.8) 56.72,37.35 56.08,37.98 39.59,37.98 v1(39.16,37.55)
M3_ENA: length 28.3
  Top Layer w0.254: v1(56.82,18.89) 58.62,18.89 58.64,18.91 X11.1 ; v1(49.91,18.94) 49.58,19.27 49.58,27.85 49.2,28.23 48.31,28.23 47.9,28.64 47.9,30.77 47.73,30.95 45.39,30.95 44.76,30.31 42.97,30.31
  Bottom Layer w0.254: v1(56.82,18.89) 49.96,18.89 v1(49.91,18.94)
M3_PUL: length 27.1
  Top Layer w0.254: v1(56.92,22.59) 57.33,22.59 57.58,22.34 57.58,20.43 57.85,20.17 59.76,20.17 X11.2 ; v1(50.24,22.64) 49.94,22.95 49.94,28.49 49.63,28.79 48.77,28.79 48.29,29.27 48.29,31.08 48.01,31.36 45.11,31.36 44.57,30.81 42.97,30.81
  Bottom Layer w0.254: v1(50.24,22.64) 50.29,22.59 v1(56.92,22.59)
OLED_CS: length 26.7
  Top Layer w0.254: v1(40.44,33.9) 40.42,33.93 40.42,35.36
  Bottom Layer w0.254: v1(40.44,33.9) 41.11,33.24 45.16,33.24 45.54,33.62 45.54,34.66 45.75,34.86 62.71,34.86 62.99,34.58 62.99,33.62
OLED_DC: length 23.8
  Top Layer w0.254: 60.45,33.62 60.45,35.88 v1(60.38,35.95) ; 41.42,35.36 42.01,35.36 42.27,35.62 42.27,36.31 42.44,36.49 43.56,36.49 43.79,36.72 v1(44.32,36.72)
  Bottom Layer w0.254: v1(60.38,35.95) 59.38,35.95 58.65,35.22 54.53,35.22 54.28,35.47 54.28,36.54 54.1,36.72 v1(44.32,36.72)
OLED_MOSI: length 20.4
  Top Layer w0.254: H25.4 54.91,34.07 v1(54.91,35.8) ; 39.92,35.36 39.92,36.55 40.23,36.86 41.6,36.86 42.14,37.4 v1(42.93,37.4)
  Bottom Layer w0.254: v1(54.91,35.8) 54.86,35.85 54.86,37.2 54.66,37.4 v1(42.93,37.4)
OLED_SCK: length 16.5
  Top Layer w0.254: v1(52.58,35.7) 52.83,35.45 52.83,33.62 ; 40.92,35.36 40.92,34.25 v1(41.27,33.9)
  Bottom Layer w0.254: v1(52.58,35.7) 44.42,35.7 43.99,35.27 43.99,34.15 43.75,33.9 v1(41.27,33.9)
OSC_IN: length 11.8
  Top Layer w0.254: 34.93,20.3 34.93,16.41 1M1.1 33.43,15.96 33.18,15.72 X1.1 33.18,9.82 33.2,9.8
OSC_OUT: length 12
  Top Layer w0.254: 35.43,20.3 35.43,16.51 1M1.2 37.11,15.96 37.29,15.79 37.29,13.08 X1.2 37.28,9.73 37.29,9.73
POWER5V: length 6.5
  Bottom Layer w0.762: U3.2 6.6,39.46 arc(6.83,40) 7.37,40.22 9.02,40.22 arc(9.56,40.44) 9.78,40.98 F1.1
RESET: length 47.1
  Top Layer w0.254: v1(37.62,17.26) 36.53,17.26 35.97,17.82 35.97,20.34 ; v1(45.54,12.56) 45.54,11.3 RESET1.1 ; H25.5 57.81,33.52 v1(57.81,31.08) ; v1(54.94,31.05) 54.36,30.47 v1(54.36,18.07)
  Bottom Layer w0.254: v1(45.54,12.56) 45.53,12.57 45.53,17.01 45.25,17.29 37.64,17.29 v1(37.62,17.26) ; R30.2 45.59,17.34 45.59,18.38 45.77,18.56 49.47,18.56 49.95,18.07 v1(54.36,18.07) ; v1(54.94,31.05) 57.78,31.05 v1(57.81,31.08)
SWCLK: length 18.2
  Top Layer w0.254: CN32.1 32.4,44.65 R10_10K3.2 32.59,42.45 32.59,41.11 32.41,40.93 31.62,40.93 31.3,40.61 v1(31.3,37.86) ; 27.92,33.89 26.6,33.89 26.29,34.2 v1(26.29,37.17)
  Bottom Layer w0.254: v1(31.3,37.86) 26.84,37.86 26.29,37.3 v1(26.29,37.17)
SWDIO: length 18.1
  Top Layer w0.254: CN32.2 30.98,42.89 R10_10K2.2 30.72,40.44 30.54,40.26 26.45,40.26 26.21,40.01 26.21,39.05 26.52,38.73 30.54,38.73 30.72,38.55 30.72,37.19 30.97,36.94 30.97,35.44
TIM2_CH1: length 22.5
  Top Layer w0.254: v1(40.77,8.29) 40.77,18.16 40.47,18.45 40.47,20.34
  Bottom Layer w0.254: v1(40.77,8.29) 47.88,8.29 48.42,7.76 CN47.4
TIM2_CH2: length 23.3
  Top Layer w0.254: 40.97,20.34 40.97,18.46 41.12,18.3 41.12,9.56 v1(41.35,9.33)
  Bottom Layer w0.254: CN47.3 49.61,5.33 49.61,8.98 49.25,9.33 v1(41.35,9.33)
TIM2_CH3: length 24
  Top Layer w0.254: v1(41.78,10.48) 41.48,10.78 41.48,18.45 41.47,18.46 41.47,20.34
  Bottom Layer w0.254: v1(41.78,10.48) 50.42,10.48 50.88,10.02 50.88,5.31 CN47.2
TIM2_CH4: length 28.1
  Top Layer w0.254: 45.03,4.03 44.68,4.38 44.68,10.45 44.55,10.57 44.55,11.88 44.68,12.01 44.68,21.4 44.26,21.81 43.02,21.81
  Bottom Layer w0.254: v1(45.03,4.1) 45.34,3.8 52.01,3.8 52.17,3.95 CN47.1
TIM3_CH1: length 24.9
  Top Layer w0.254: v1(54.94,24.17) 55.02,24.17 55.27,23.91 55.27,17.11 55.73,16.65 v1(56.84,16.65) ; 43.02,24.31 45.17,24.31 45.34,24.14 46.03,24.14
  Bottom Layer w0.254: v1(56.84,16.65) 58.22,16.65 58.47,16.9 58.47,17.59 58.65,17.77 58.9,17.77 59.03,17.65 CN48.4 ; v1(54.94,24.17) 54.89,24.22 v1(46.03,24.22)
TIM3_CH2: length 24.6
  Top Layer w0.254: v1(55.27,24.98) 55.57,24.98 55.83,24.73 55.83,17.92 56.01,17.74 v1(56.84,17.74) ; v1(45.62,24.97) 45.53,24.89 43.02,24.89
  Bottom Layer w0.254: v1(56.84,17.74) 57.81,17.74 58.09,18.02 58.09,18.58 58.27,18.76 59.63,18.76 CN48.3 ; v1(45.62,24.97) 55.26,24.97 v1(55.27,24.98)
TIM3_CH3: length 22.6
  Top Layer w0.254: 42.97,26.31 47.05,26.31 47.19,26.18 47.19,20.71 47.55,20.36 48.67,20.36 v1(48.72,20.31)
  Bottom Layer w0.254: CN48.2 59.61,20.31 v1(48.72,20.31)
TIM3_CH4: length 21.8
  Top Layer w0.254: 43.02,26.84 47.35,26.84 47.6,26.59 47.6,21.78 47.96,21.43 48.72,21.43
  Bottom Layer w0.254: v1(48.72,21.48) 59.69,21.48 CN48.1
USART1_RX: length 24
  Top Layer w0.254: v1(38.7,43.07) 38.7,44.73 X6.2 ; v1(35.15,30.98) 32.94,30.98 32.42,31.5 32.42,35.36
  Bottom Layer w0.254: v1(38.7,43.07) 38.54,42.91 35.46,42.91 35.15,42.6 v1(35.15,30.98)
USART1_TX: length 23.2
  Top Layer w0.254: X6.1 39.83,44.79 v1(39.83,42.63) ; v1(35.84,31.69) 33.25,31.69 32.92,32.02 32.92,35.36
  Bottom Layer w0.254: v1(39.83,42.63) 39.68,42.48 36.19,42.48 35.84,42.13 v1(35.84,31.69)
USART2_RX: length 35.5
  Top Layer w0.254: v1(7.24,15.33) X5.2 ; 27.92,28.39 25.18,28.39 24.87,28.08 24.87,24.2 23.88,23.21 v1(23.88,15)
  Bottom Layer w0.254: v1(23.88,15) 8.97,15 8.64,15.33 v1(7.24,15.33)
USART2_TX: length 34.3
  Top Layer w0.254: 27.92,28.89 24.74,28.89 24.51,28.66 24.51,24.35 23.24,23.08 v1(23.24,16.6) ; v1(6.6,16.47) 5.41,16.47 5.18,16.71
  Bottom Layer w0.254: v1(23.24,16.6) 6.73,16.6 v1(6.6,16.47)
USART3_RX: length 24.4
  Top Layer w0.254: 42.97,32.81 44.69,32.81 v1(44.98,32.53)
  Bottom Layer w0.254: v1(44.98,32.53) 46.75,32.53 46.79,32.49 60.67,32.49 61.26,31.89 61.26,27.83 61.09,27.65 X7.2
USART3_TX: length 19.7
  Top Layer w0.254: v1(44.45,31.86) 44,32.31 42.97,32.31
  Bottom Layer w0.254: v1(44.45,31.86) 59.38,31.86 59.72,31.53 59.72,28.9 X7.1
USART4_RX: length 31.4
  Top Layer w0.254: 27.92,32.39 22.9,32.39 22.68,32.17 v1(22.68,23.64) ; CN46.3 v1(7.75,23.59)
  Bottom Layer w0.254: v1(7.75,23.59) 22.64,23.59 v1(22.68,23.64)
USART4_TX: length 33
  Top Layer w0.254: v1(21.59,22.31) 21.84,22.31 22.1,22.57 22.1,32.6 22.39,32.89 27.92,32.89 ; v1(7.75,22.31) 5.21,22.31 CN46.4
  Bottom Layer w0.254: v1(21.59,22.31) v1(7.75,22.31)
USART5_RX: length 27.9
  Top Layer w0.254: v1(23.88,25.23) 23.88,30.06 24.21,30.39 27.92,30.39
  Bottom Layer w0.254: v1(23.88,25.23) 6.98,25.23 6.6,24.85 X8.2
USART5_TX: length 30.3
  Top Layer w0.254: v1(23.27,24.35) 23.27,31.43 23.72,31.89 27.92,31.89
  Bottom Layer w0.254: v1(23.27,24.35) 23.14,24.22 7.49,24.22 6.88,23.6 X8.1
USART6_RX: length 30.6
  Top Layer w0.254: 34.92,35.36 34.92,33.14 35.36,32.7 v1(37.31,32.7)
  Bottom Layer w0.254: v1(37.31,32.7) 37.31,41.21 37.64,41.54 51,41.54 51.18,41.72 51.18,44.67 X13.2
USART6_TX: length 30.5
  Top Layer w0.254: 35.42,35.36 35.41,35.35 35.41,33.64 35.56,33.49 v1(36.73,33.49)
  Bottom Layer w0.254: v1(36.73,33.49) 36.73,41.57 37.21,42.05 40.59,42.05 40.77,42.23 40.77,43.7 40.95,43.88 42.12,43.88 42.3,43.7 42.3,42.23 42.48,42.05 49.68,42.05 50.08,42.45 X13.1
$1N9363: length 4.2
  Top Layer w0.254: v1(39.27,32.68) 41.22,32.68 41.43,32.88 41.43,33.24 41.51,33.31 42.97,33.31
$1N9364: length 2.7
  Top Layer w0.254: 30.47,35.44 30.47,32.79 v1(30.53,32.73)
$1N9368: length 18.6
  Top Layer w0.254: v1(40.66,22.82) 40.66,22.16 40.56,22.06 40.18,22.06 39.93,21.81 39.93,20.38 ; v1(39.53,22.82) 39.47,22.76 39.47,20.34
  Bottom Layer w0.254: v1(39.53,22.82) 39.31,23.04 2.2uf.2 C34_106.1 C35_104.1 40.49,28.69 40.66,28.51 v1(40.66,22.82)
$1N9402: length 5.3
  Bottom Layer w0.254: v1(20.45,8.98) 20.51,8.91 C1.1 23.18,8.98 R6_1k1.2
$1N9403: length 5.4
  Bottom Layer w0.254: R7_1K1.2 25.73,3.07 C56.1 v1(20.45,3.07)
$1N9404: length 5.5
  Bottom Layer w0.254: R8_1K1.2 12.51,8.98 12.45,9.04 v1(9.65,9.04)
$1N9411: length 5.6
  Top Layer w0.254: v1(9.78,3.01) key4.1
  Bottom Layer w0.254: v1(9.78,3.01) 9.84,2.94 12.83,2.94 12.9,2.87 R31_1K1.2
$1N9414: length 2.8
  Top Layer w0.381: 3V1.1 R10_10K1.2
$1N9417: length 2.8
  Top Layer w0.762: R13_10K1.2 5V1.1
$1N9419: length 3.3
  Top Layer w0.254: R10_2K1.2 LED2.1
$1N9423: length 3.3
  Top Layer w0.254: R13_2K1.2 LED1.1
$1N9463: length 3.6
  Bottom Layer w0.762: 11.94,45.3 11.94,41.87 arc(11.98,41.78) F1.2
$1N9534: length 3.3
  Top Layer w0.254: R10_2K2.2 18.16,12.94 LED3.1
$1N9680: length 6.5
  Top Layer w0.254: U13.6 41.81,38.7 42.09,38.42 44.67,38.42 D1.1 46.47,38.59 F3.1
$1N9681: length 6.6
  Top Layer w0.254: 40.68,39.97 41.55,39.97 42.07,40.48 D1.2 46.5,40.48 F4.1
$1N9688: length 3.5
  Top Layer w0.254: C27.1 57.05,40.18 55.32,40.18 55.35,40.15 R20.2
$1N17080: length 2.8
  Bottom Layer w0.254: H29.2 60.3,39.59 v1(60.25,39.54)

## Copper pours and planes (outline as drawn; the poured copper is in the pictures)
GND on Top Layer: -1.12,53.18 67.01,53.18 67.01,-2.1 -1.12,-2.1
GND on Bottom Layer: 20.7,38.44 25.78,38.44 25.78,33.36 20.7,33.36
GND on Bottom Layer: -5.16,53.4 72.54,53.4 72.54,-9.74 -5.16,-9.74
VCC3V3 on Top Layer: 20.7,43.9 25.78,43.9 25.78,38.82 20.7,38.82
VCC5V on Top Layer: 20.7,49.49 25.78,49.49 25.78,44.41 20.7,44.41

Small or netless copper shapes (teardrops, artwork), in the pictures only: 282 on Top Layer, 156 on Bottom Layer

## Text on the board
Bottom Silkscreen Layer: CAN_H | CAN_L | TX5 | RX5 | TIM2_CH1 | TIM2_CH2 | TX6 | RX6 | GND | TIM2_CH3 | TIM2_CH4 | TX3 | RX3 | TIM3_CH3 | TIM3_CH4 | TIM3_CH1
Top Silkscreen Layer: FRE4 | FRE3 | FRE2 | FRE1 | KEY4 | KEY3 | KEY2 | KEY1 | G | RX1 | TX1 | CAN_L | KEY  RESET | CAN_H | ENA2 | ENA1 | PUL2 | PUL1 | DIR2 | PUL3 | DIR3 | ENA3 | DIR1 | 3V3 | GND | SLK | MOSI | RET | DC | 22pf | OFF | 5V | TX4 | RX4 | ON | DIO | CLK | TX2 | RX2
